# Altium schematic sheet SDEC944-xD_Machines_laver_1-2_(d‚tection_fuites).SchDoc: Machines à laver 1/2 (détection fuites)
size 393 x 270 mm; CompanyName: Seccom; Address1: 521, rue du capt. François Garbit; Address2: 69440 Mornant; Address3: seccom@seccom.fr; Address4: www.seccom.fr; DocumentNumber: 16; SheetNumber: 16; SheetTotal: 22; PageSetup: Record=PageOptions|CenterHorizontal=True|CenterVertical=True|PrintScale=0.74|XCorrection=1.00|YCorrection=1.00|PrintKind=0|BorderSize=5000000|LeftOffset=0|BottomOffset=0|Orientation=2|PaperLength=1000|PaperWidth=1000|Scale=100|PaperSource=7|PrintQuality=-4|MediaType=1|DitherType=10|PaperKind=A4|PrintScaleMode=1
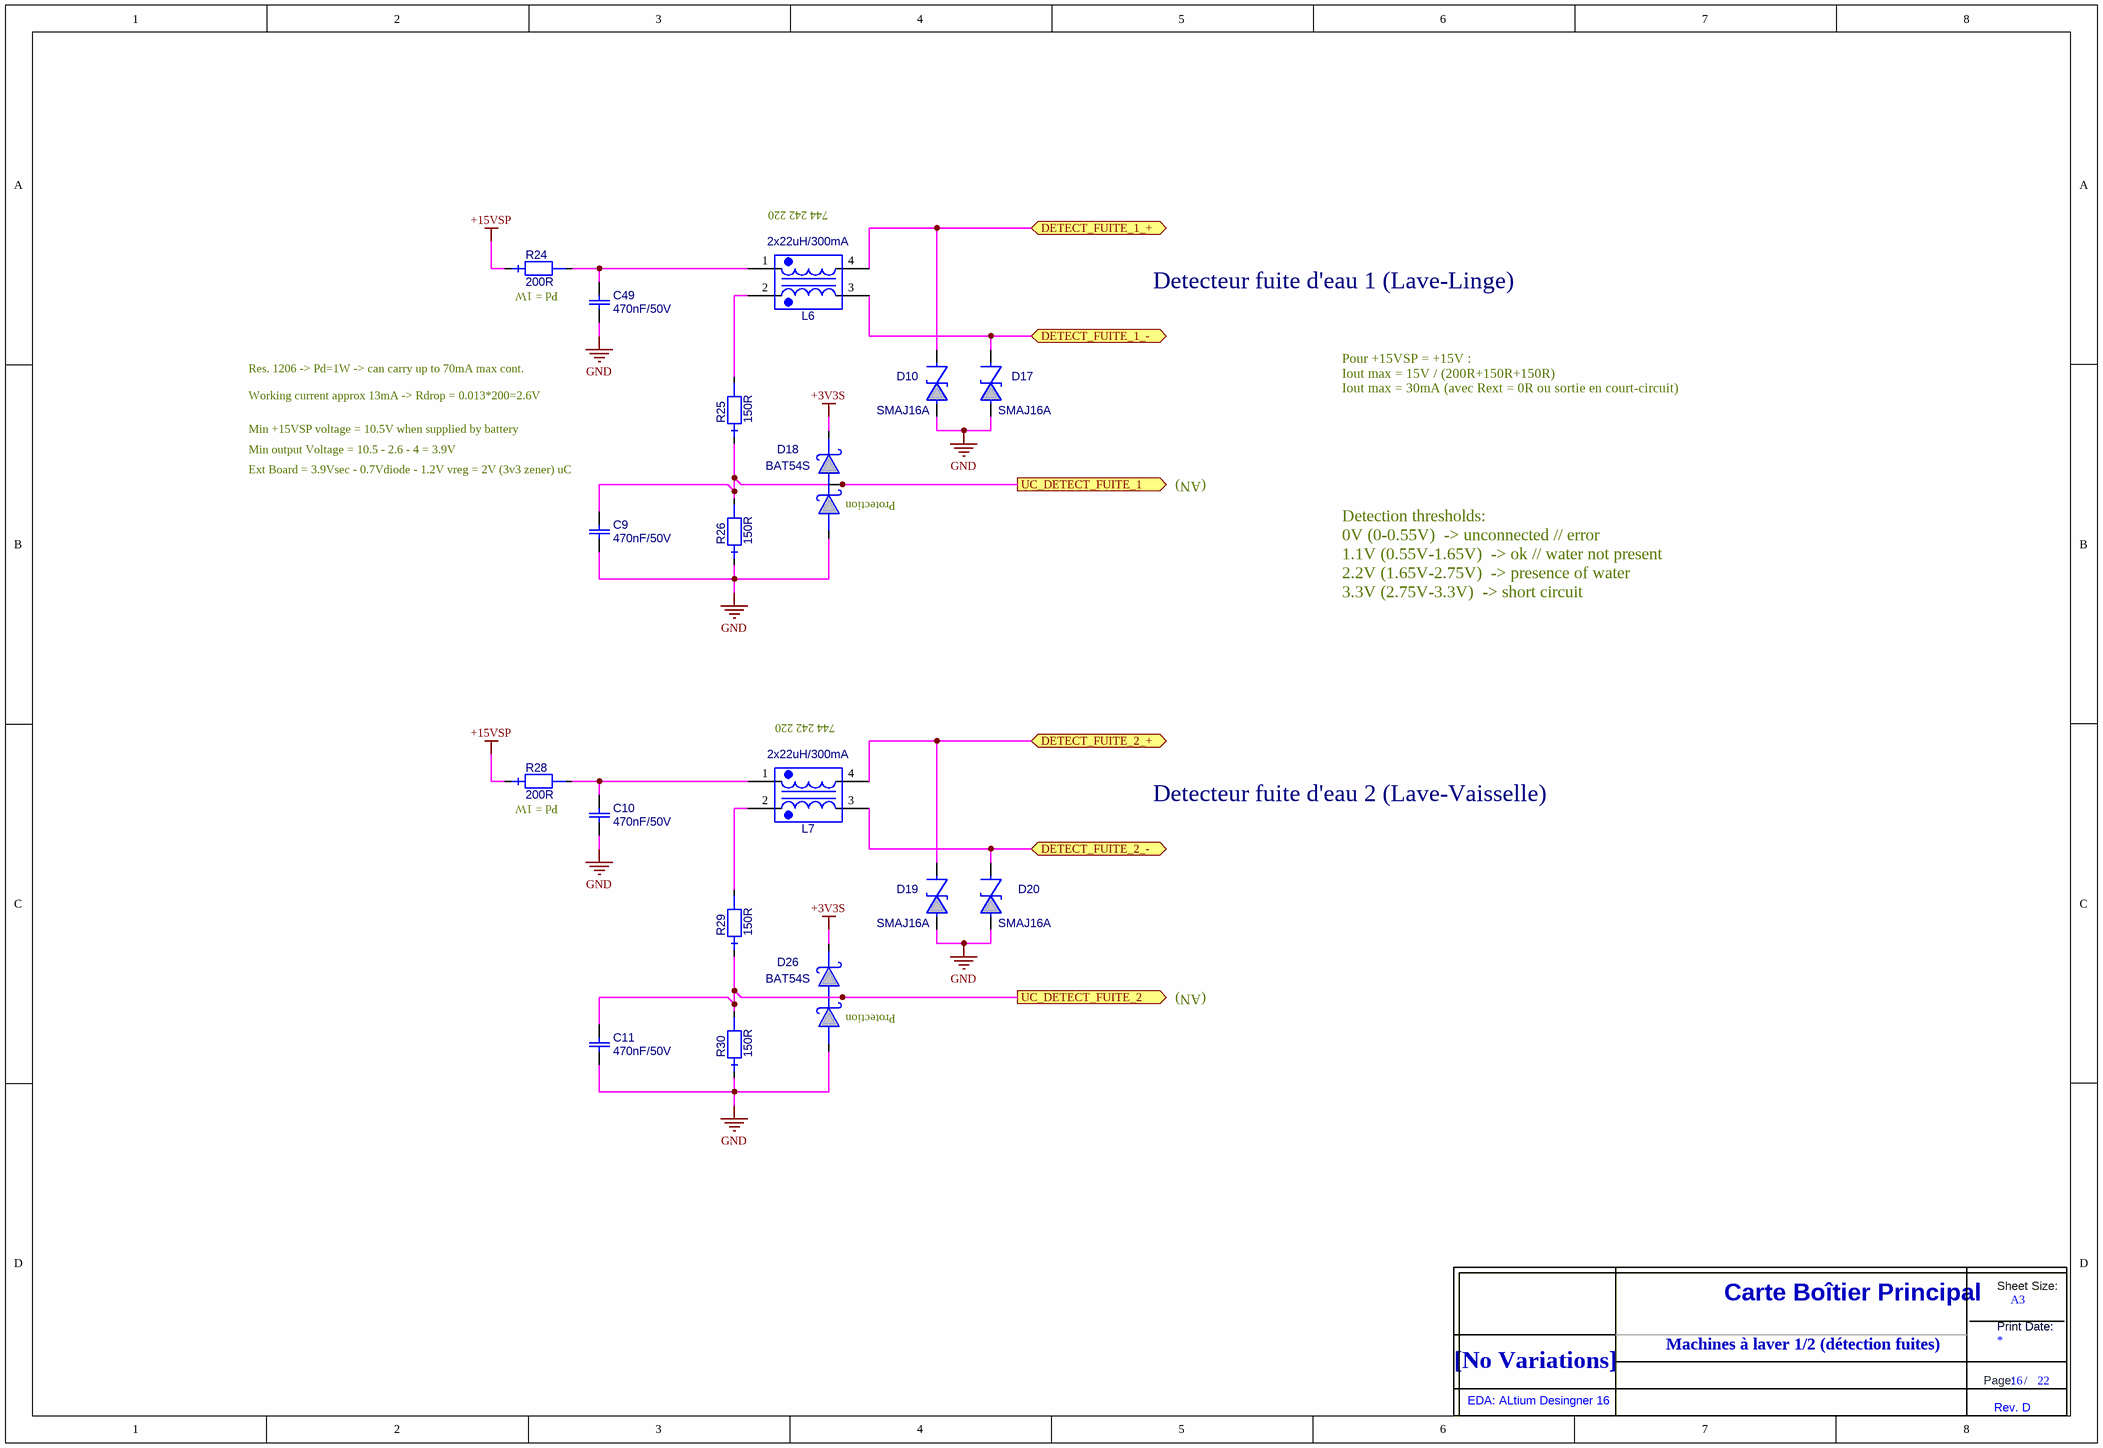
[diagram p0: SDEC944-xD_Machines_laver_1-2_(d‚tection_fuites).SchDoc]

## Parts
C9  value 470nF/50V  [0805_ReflowSoldering_CAP]  (hidden comment: C_0805_X7R_10%_470N-50V)
C10  value 470nF/50V  [0805_ReflowSoldering_CAP]  (hidden comment: C_0805_X7R_10%_470N-50V)
C11  value 470nF/50V  [0805_ReflowSoldering_CAP]  (hidden comment: C_0805_X7R_10%_470N-50V)
C49  value 470nF/50V  [0805_ReflowSoldering_CAP]  (hidden comment: C_0805_X7R_10%_470N-50V)
D10  SMAJ16A  [DO214AC-SMA-P_ReflowSoldering]
D17  SMAJ16A  [DO214AC-SMA-P_ReflowSoldering]
D18  BAT54S  [SOT23_3L_ReflowSoldering]
D19  SMAJ16A  [DO214AC-SMA-P_ReflowSoldering]
D20  SMAJ16A  [DO214AC-SMA-P_ReflowSoldering]
D26  BAT54S  [SOT23_3L_ReflowSoldering]
L6  value 2x22uH/300mA  [SELF_WE-SLM_6x3.3H3.3mm]  (hidden comment: IND_FERRITE_WE-SLM_2X22UH)
L7  value 2x22uH/300mA  [SELF_WE-SLM_6x3.3H3.3mm]  (hidden comment: IND_FERRITE_WE-SLM_2X22UH)
R24  value 200R  [2512_ReflowSoldering_RES]  (hidden comment: RES_2512_5%_200PPM_200R_500V)
R25  value 150R  [0603_ReflowSoldering_RES]  (hidden comment: RES_0603_1%_100PPM_150R)
R26  value 150R  [0603_ReflowSoldering_RES]  (hidden comment: RES_0603_1%_100PPM_150R)
R28  value 200R  [2512_ReflowSoldering_RES]  (hidden comment: RES_2512_5%_200PPM_200R_500V)
R29  value 150R  [0603_ReflowSoldering_RES]  (hidden comment: RES_0603_1%_100PPM_150R)
R30  value 150R  [0603_ReflowSoldering_RES]  (hidden comment: RES_0603_1%_100PPM_150R)
Title_new  DNI  (value not drawn)  (graphical)

## Ports
DETECT_FUITE_1_+ (bidir), DETECT_FUITE_1_- (bidir), DETECT_FUITE_2_+ (bidir), DETECT_FUITE_2_- (bidir), UC_DETECT_FUITE_1 (out), UC_DETECT_FUITE_2 (out)

## Nets
+3V3S: D18.2 D26.2
+15VSP: R24.1 R28.1
GND: C9.1 C10.1 C11.1 C49.1 D10.A D17.A D18.1 D19.A D20.A D26.1 R26.1 R30.1
DETECT_FUITE_1_+: D10.K L6.4 ; port DETECT_FUITE_1_+
DETECT_FUITE_1_-: D17.K L6.3 ; port DETECT_FUITE_1_-
DETECT_FUITE_2_+: D19.K L7.4 ; port DETECT_FUITE_2_+
DETECT_FUITE_2_-: D20.K L7.3 ; port DETECT_FUITE_2_-
UC_DETECT_FUITE_1: C9.2 D18.3 R25.1 R26.2 ; port UC_DETECT_FUITE_1
UC_DETECT_FUITE_2: C11.2 D26.3 R29.1 R30.2 ; port UC_DETECT_FUITE_2
NetC10_2: C10.2 L7.1 R28.2
NetC49_2: C49.2 L6.1 R24.2
NetL6_2: L6.2 R25.2
NetL7_2: L7.2 R29.2

## Notes on the sheet
- (near L6) 744 242 220
- (near R24) Pd = 1W
- Detecteur fuite d'eau 1 (Lave-Linge)
- Res. 1206 -> Pd=1W -> can carry up to 70mA max cont.
- Working current approx 13mA -> Rdrop = 0.013*200=2.6V
- Min output Voltage = 10.5 - 2.6 - 4 = 3.9V
- Min +15VSP voltage = 10.5V when supplied by battery
- Pour +15VSP = +15V :
  Iout max = 15V / (200R+150R+150R)
  Iout max = 30mA (avec Rext = 0R ou sortie en court-circuit)
- (near C9) Ext Board = 3.9Vsec - 0.7Vdiode - 1.2V vreg = 2V (3v3 zener) uC
- (near D18) Protection
- (AN)
- Detection thresholds:
  0V (0-0.55V)  -> unconnected // error
  1.1V (0.55V-1.65V)  -> ok // water not present
  2.2V (1.65V-2.75V)  -> presence of water
  3.3V (2.75V-3.3V)  -> short circuit
- (near L7) 744 242 220
- (near R28) Pd = 1W
- Detecteur fuite d'eau 2 (Lave-Vaisselle)
- (near D26) Protection
- Machines à laver 1/2 (détection fuites)
- (in symbol Title_new) Sheet Size:; Carte Boîtier Principal; A3; Print Date:; [No Variations]; Page:; /; EDA: ALtium Desingner 16; Rev. D

## Library data of the parts
C9-C11 C49 = C_0805_X7R_10%_470N-50V: Condensateur céramique, X7R, 10%, CMS 0805, 470nF/50V; Creation: FB (02/10/12); Boitier: 0805; Remarque: {Remarque}; Coeff: 1; Fabricant: Kemet; Ref Fab: C0805C471K5RAC; Verification: *; ComponentLink1URL: O:\_Documentation\Datasheets\Kemet\Condos_Ceramic_CMS.pdf; ComponentLink2URL: o:\_Documentation\Datasheets\_BOITIERS\PASSIF_CMS\RC_0805_(2x1,25)_(Schneider).PDF; Config: *; ComponentLink1Description: Datasheet; ComponentLink2Description: Datasheet Boitier; Supplier 1: Mouser; Supplier Part Number 1: 80-C0805C471K5R
D10 D17 D19 D20 = SMAJ16A: Diode Transil/TVS unidirectionnelle (A), Transzorb, 400W, 16V, CMS; Creation: ZA (29/07/13); Boitier: DO214AC/SMA; Remarque: {Remarque}; Coeff: 1; Fabricant: Bourns; ComponentLink1URL: o:\_Documentation\Datasheets\Bourns\SMAJ-74970.pdf; ComponentLink2URL: o:\_Documentation\Datasheets\_BOITIERS\ACTIF_CMS\SMx\SMB_(Schneider).lnk; Config: *; ComponentLink1Description: Datasheet; ComponentLink2Description: Datasheet Boitier; Ref Fab: SMAJ16A; Supplier 1: Farnell; Supplier Part Number 1: 1843352; Supplier 2: Mouser; Supplier Part Number 2: 652-SMAJ16A; Value: SMAJ16A
D18 D26 = BAT54S: Diode Schottky double, BAT54 en série, Vrrm=30V, If=200mA, Vf=0.4Vmax, CMS; Creation: JMP 05/09/2002; Verification: GO (26/09/02); Reference: 000206/00; Boitier: SOT23_3L; Remarque: {Remarque}; Coeff: 1; Fabricant: NXP; ComponentLink1URL: O:\_Documentation\Datasheets\NXP\BAT54_series.pdf; ComponentLink2URL: o:\_Documentation\Datasheets\_BOITIERS\ACTIF_CMS\SOT\SOT_23_3P_(Schneider).PDF; Config: *; ComponentLink1Description: Datasheet; ComponentLink2Description: Datasheet Boitier; Ref Fab: BAT54S; Supplier 1: Farnell; Supplier Part Number 1: 1081194; Value: BAT54S; Supplier 2: Mouser; Supplier Part Number 2: 771-BAT54S-T/R
L6 L7 = IND_FERRITE_WE-SLM_2X22UH: Filtre double ferrite, 2x22uH, 42Vac/80Vdc, 300mA, serie WE-SLM, -40/+125°C, CMS; Creation: PDP (26/09/12); Boitier: WE-SLM_6x3.3_h3.3mm; Coeff: 1; Fabricant: Wurth Elektronik; Ref Fab: 744242220; ComponentLink1URL: O:\_Documentation\Datasheets\Wurth_Elektronik\744242220-29314.pdf; ComponentLink2URL: o:\_Documentation\Datasheets\_BOITIERS\; Config: *; ComponentLink1Description: Datasheet; ComponentLink2Description: Datasheet Boitier; Supplier 1: Mouser; Supplier Part Number 1: 710-744242220; Supplier 2: Farnell; Supplier Part Number 2: 2082589
R24 R28 = RES_2512_5%_200PPM_200R_500V: Résistance, 1W, 5%, 200ppm, 500V, 200R; Creation: FB (31/08/12); Boitier: 2512; Remarque: {Remarque}; Coeff: 1; Fabricant: Vishay; Ref Fab: CRCW2512200RJNEG; ComponentLink1URL: O:\_Documentation\Datasheets\Vishay\dcrcw.pdf; ComponentLink2URL: o:\_Documentation\Datasheets\_BOITIERS\PASSIF_CMS\R_2512_(6,4x3,2)_(Schneider).PDF; Config: *; ComponentLink1Description: Datasheet; ComponentLink2Description: Datasheet Boitier
R25 R26 R29 R30 = RES_0603_1%_100PPM_150R: Résistance, 0.100W, 1%, 100ppm, 75V, 150R; Creation: FB (17/07/12); Boitier: 0603; Remarque: {Remarque}; Fabricant: Vishay; Ref Fab: CRCW0603150RFKEA; Coeff: 1; Verification: *; ComponentLink1URL: O:\_Documentation\Datasheets\Vishay\Resistances_D-CRCWe3.pdf; ComponentLink2URL: o:\_Documentation\Datasheets\_BOITIERS\PASSIF_CMS\; Config: *; ComponentLink1Description: Datasheet; ComponentLink2Description: Datasheet Boitier; Supplier 1: Farnell; Supplier 2: Mouser; Supplier Part Number 1: 1469760; Supplier Part Number 2: 71-CRCW0603-150-E3
Title_new = Title_new